# EAGLE design 5-Band 50W PA_50W PA_OCP (EAGLE 9.4.2)
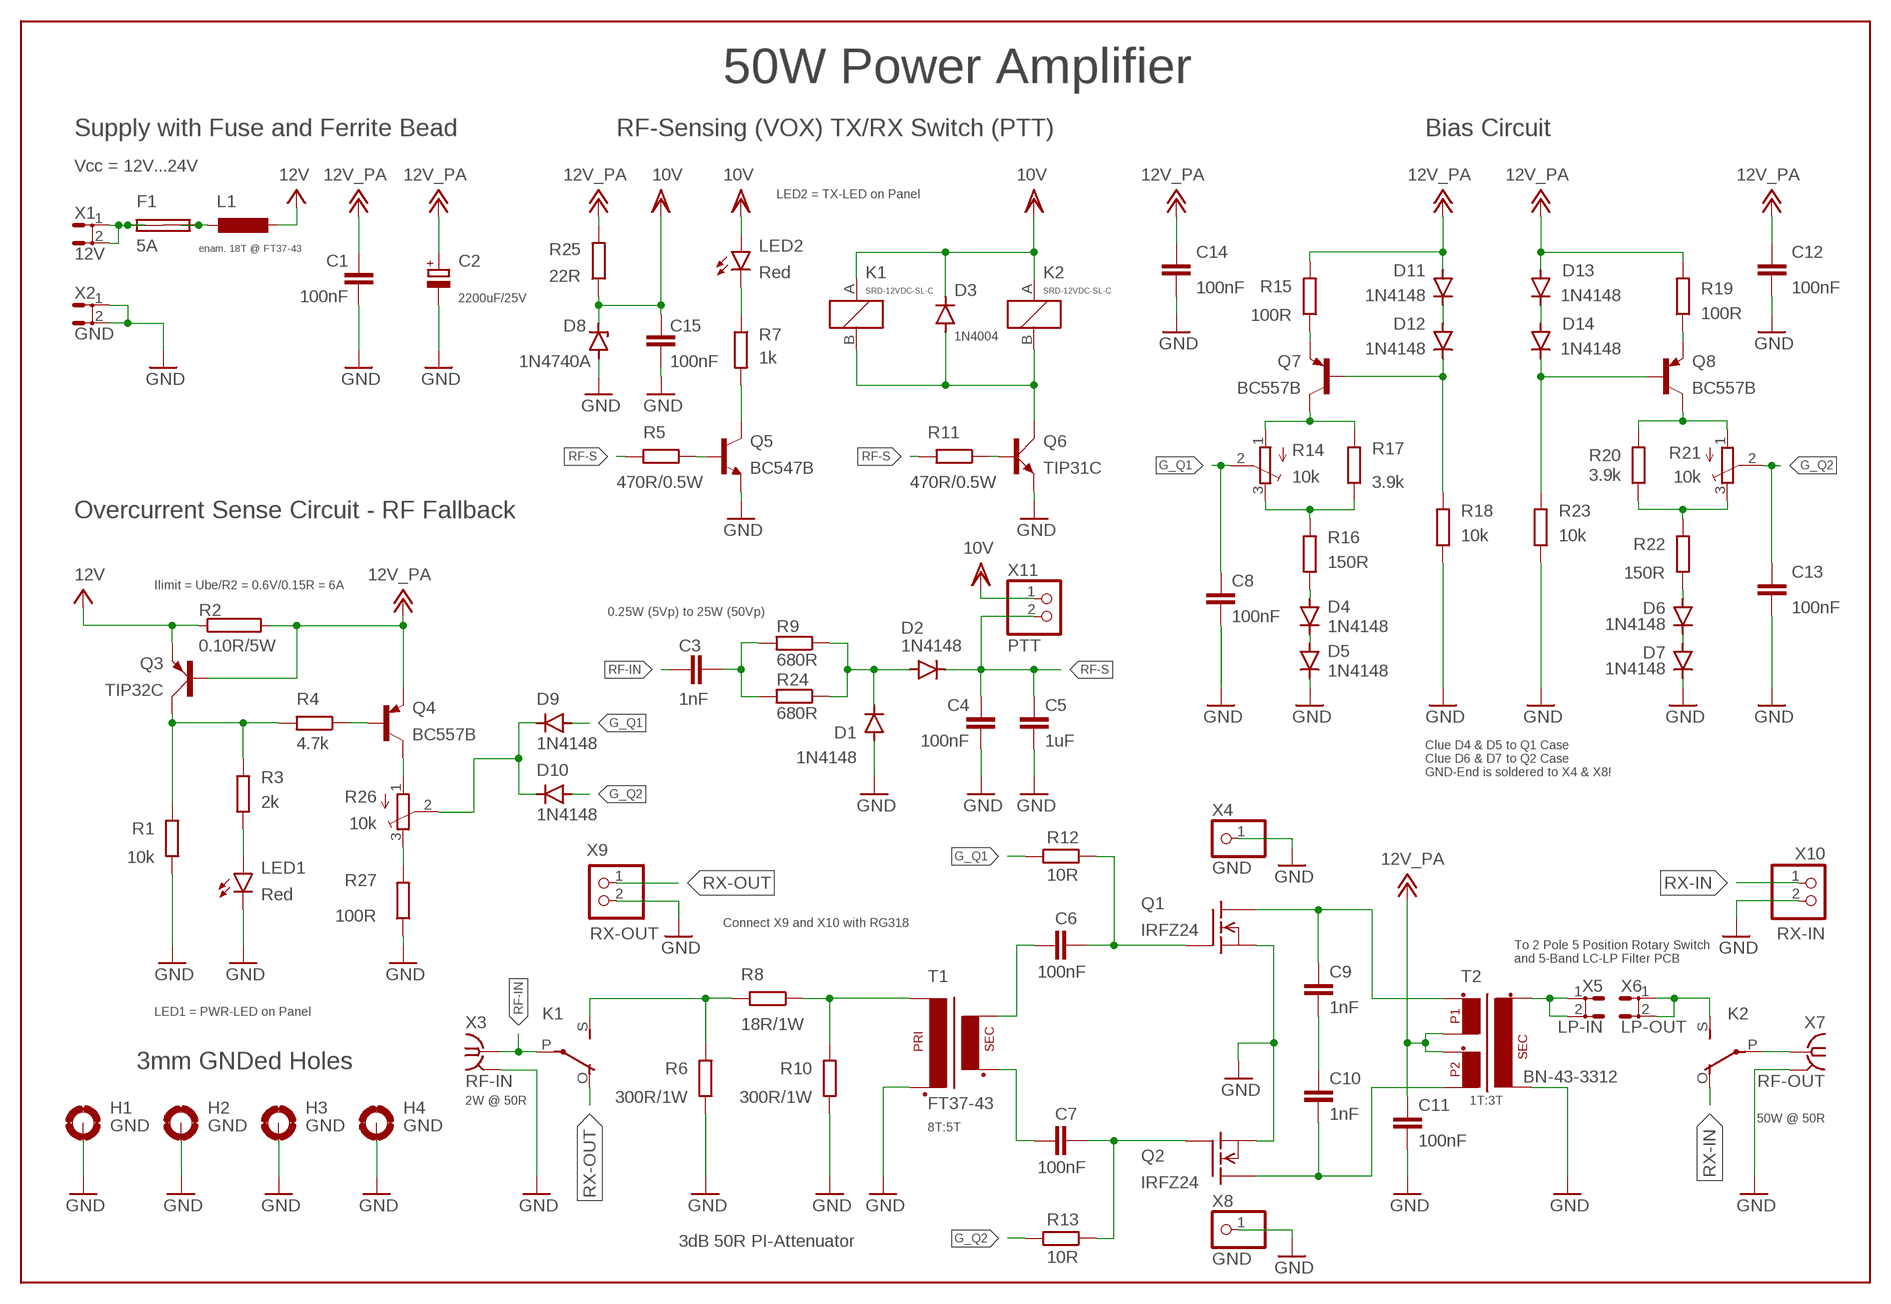
[diagram p0: schematic, sheet 1]

## Parts
C1  100nF  C-EUC0805  [C0805]
C2  2200uF/25V  CPOL-EUE7.5-16  [E7,5-16]
C3  1nF  C-EUC0805  [C0805]
C4  100nF  C-EUC0805  [C0805]
C5  1uF  C-EUC0805  [C0805]
C6  100nF  C-EUC0805  [C0805]
C7  100nF  C-EUC0805  [C0805]
C8  100nF  C-EUC0805  [C0805]
C9  1nF  C-EUC1206K  [C1206K]
C10  1nF  C-EUC1206K  [C1206K]
C11  100nF  C-EUC0805  [C0805]
C12  100nF  C-EUC0805  [C0805]
C13  100nF  C-EUC0805  [C0805]
C14  100nF  C-EUC0805  [C0805]
C15  100nF  C-EUC0805  [C0805]
D1  1N4148  DIODE-SOD323-W  [SOD323-W]
D2  1N4148  DIODE-SOD323-W  [SOD323-W]
D3  1N4004  [DO41-10]
D4  1N4148  1N4148DO35-7  [DO35-7]
D5  1N4148  1N4148DO35-7  [DO35-7]
D6  1N4148  1N4148DO35-7  [DO35-7]
D7  1N4148  1N4148DO35-7  [DO35-7]
D8  1N4740A  1N4728  [DO41Z10]
D9  1N4148  DIODE-SOD323-W  [SOD323-W]
D10  1N4148  DIODE-SOD323-W  [SOD323-W]
D11  1N4148  DIODE-SOD323-W  [SOD323-W]
D12  1N4148  DIODE-SOD323-W  [SOD323-W]
D13  1N4148  DIODE-SOD323-W  [SOD323-W]
D14  1N4148  DIODE-SOD323-W  [SOD323-W]
F1  5A  SHK20L  [SHK20L]
H1  GND  MOUNT-PAD-ROUND3.0  [3,0-PAD]
H2  GND  MOUNT-PAD-ROUND3.0  [3,0-PAD]
H3  GND  MOUNT-PAD-ROUND3.0  [3,0-PAD]
H4  GND  MOUNT-PAD-ROUND3.0  [3,0-PAD]
K1  SRD-12VDC-SL-C  [SRD-12VDC-SL-C]
K2  SRD-12VDC-SL-C  [SRD-12VDC-SL-C]
L1  enam. 18T @ FT37-43  T50-6  [T50-6SMD]
LED1  Red  LED5MM  [LED5MM]
LED2  Red  LED5MM  [LED5MM]
Q1  IRFZ24  IRF510  [TO220]
Q2  IRFZ24  IRF510  [TO220]
Q3  TIP32C  TIP42C  [TO220AV]
Q4  BC557B  [TO92-EBC]
Q5  BC547B  BC547B-NPN-TO92-CBE  [TO92-CBE]
Q6  TIP31C  TIP41C  [TO220AV]
Q7  BC557B  [TO92-EBC]
Q8  BC557B  [TO92-EBC]
R1  10k  R-EU_R0805  [R0805]
R2  0.10R/5W  RMNS-5  [MNS-5]
R3  2k  R-EU_R0805  [R0805]
R4  4.7k  R-EU_R0805  [R0805]
R5  470R/0.5W  R-EU_0207/10  [0207/10]
R6  300R/1W  R-EU_0414/15  [0414/15]
R7  1k  R-EU_R0805  [R0805]
R8  18R/1W  R-EU_0414/15  [0414/15]
R9  680R  R-EU_R0805  [R0805]
R10  300R/1W  R-EU_0414/15  [0414/15]
R11  470R/0.5W  R-EU_0207/10  [0207/10]
R12  10R  R-EU_0207/10  [0207/10]
R13  10R  R-EU_0207/10  [0207/10]
R14  10k  TRIM_EU-3223G  [3223G]
R15  100R  R-EU_R0805  [R0805]
R16  150R  R-EU_R0805  [R0805]
R17  3.9k  R-EU_R0805  [R0805]
R18  10k  R-EU_R0805  [R0805]
R19  100R  R-EU_R0805  [R0805]
R20  3.9k  R-EU_R0805  [R0805]
R21  10k  TRIM_EU-3223G  [3223G]
R22  150R  R-EU_R0805  [R0805]
R23  10k  R-EU_R0805  [R0805]
R24  680R  R-EU_R0805  [R0805]
R25  22R  R-EU_0207/10  [0207/10]
R26  10k  TRIM_EU-3223G  [3223G]
R27  100R  R-EU_R0805  [R0805]
T1  FT37-43  [FT37-43SMD]
T2  BN-43-3312  BN-43-3312CENTERTAP  [BN-43-3312CENTERTAPSMD]
X1  12V  ST6,3  [ST6,3]
X2  GND  ST6,3  [ST6,3]
X3  RF-IN  SMA-PCB-CON142-0711-821/826  [J502-ND-142-0711-821/826]
X4  GND  PINHD-1X1  [1X01]
X5  LP-IN  ST6,3  [ST6,3]
X6  LP-OUT  ST6,3  [ST6,3]
X7  RF-OUT  SMA-PCB-CON142-0711-821/826  [J502-ND-142-0711-821/826]
X8  GND  PINHD-1X1  [1X01]
X9  RX-OUT  PINHD-1X2  [1X02]
X10  RX-IN  PINHD-1X2  [1X02]
X11  PTT  PINHD-1X2  [1X02]

## Nets
+12V: C1.2 C2.+ C11.2 C12.2 C14.2 D11.A D13.A Q3.B Q4.E R2.2 R15.2 R19.2 R25.2 T2.P$2(P1_2) T2.P$3(P2_1) ; supply symbol labelled 12V_PA
G_Q1: C8.2 D9.A R12.2 R14.2(S)
G_Q2: C13.2 D10.A R13.2 R21.2(S)
GND: C1.1 C2.- C4.1 C5.1 C8.1 C11.1 C12.1 C13.1 C14.1 C15.1 D1.A D5.C D7.C D8.A H1.B3,0(MOUNT) H2.B3,0(MOUNT) H3.B3,0(MOUNT) H4.B3,0(MOUNT) LED1.K(C) Q1.3(S) Q2.3(S) Q5.E Q6.E R1.1 R6.1 R10.1 R18.1 R23.1 R27.1 T1.P$2(P2) T2.S$2(S2) X2.1 X2.2 X3.G@1(GND) X3.G@2(GND) X3.G@3(GND) X3.G@4(GND) X4.1 X7.G@1(GND) X7.G@2(GND) X7.G@3(GND) X7.G@4(GND) X8.1 X9.2 X10.2
N$1: C6.2 T1.S$1(S1)
N$2: C7.2 T1.S$2(S2)
N$3: LED2.K(C) R7.1
N$4: Q8.C R20.2 R21.1(A)
N$5: Q7.E R15.1
N$6: C9.1 Q1.2(D) T2.P$1(P1_1)
N$7: R20.1 R21.3(E) R22.2
N$8: C10.2 Q2.2(D) T2.P$4(P2_2)
N$9: K1.S R6.2 R8.2
N$10: K2.P X7.1(RF)
N$11: R8.1 R10.2 T1.P$1(P1)
N$12: D9.C D10.C R26.2(S)
N$13: D6.C D7.A
N$14: Q8.E R19.1
N$15: Q7.C R14.1(A) R17.2
N$16: D4.C D5.A
N$17: R14.3(E) R16.2 R17.1
N$18: D4.A R16.1
N$19: D6.A R22.1
N$20: D12.C Q7.B R18.2
N$21: C6.1 Q1.1(G) R12.1
N$22: C7.1 Q2.1(G) R13.1
N$23: K2.S X6.1 X6.2
N$24: D3.A K1.B(1:B) K2.B(1:B) Q6.C
N$25: D1.C D2.A R9.1 R24.1
N$26: D14.C Q8.B R23.2
N$27: Q6.B R11.1
N$28: F1.1A F1.1B X1.1 X1.2
N$29: R26.3(E) R27.2
N$30: F1.2A F1.2B L1.P$1
N$31: D11.C D12.A
N$32: Q5.C R7.2
N$33: Q5.B R5.1
N$34: C3.1 R9.2 R24.2
N$35: Q3.C R1.2 R3.2 R4.2
N$36: C9.2 C10.1
N$37: LED1.A R3.1
N$38: Q4.B R4.1
N$39: T2.S$1(S1) X5.1 X5.2
N$40: D13.C D14.A
N$41: Q4.C R26.1(A)
RF-IN: C3.2 K1.P X3.1(RF)
RF-S: C4.2 C5.2 D2.C R5.2 R11.2 X11.2
RX-IN: K2.O X10.1
RX-OUT: K1.O X9.1
VCC: L1.P$2 Q3.E R2.1 ; supply symbol labelled 12V
VDD: C15.2 D3.C D8.C K1.A(1:A) K2.A(1:A) LED2.A R25.1 X11.1 ; supply symbol labelled 10V

## Notes on the sheet
- 50W Power Amplifier
- Supply with Fuse and Ferrite Bead | RF-Sensing (VOX) TX/RX Switch (PTT) | Bias Circuit
- Vcc = 12V...24V
- LED2 = TX-LED on Panel
- Overcurrent Sense Circuit - RF Fallback
- Ilimit = Ube/R2 = 0.6V/0.15R = 6A
- 0.25W (5Vp) to 25W (50Vp)
- Clue D4 & D5 to Q1 Case
  Clue D6 & D7 to Q2 Case
  GND-End is soldered to X4 & X8!
- Connect X9 and X10 with RG318
- To 2 Pole 5 Position Rotary Switch 
  and 5-Band LC-LP Filter PCB
- LED1 = PWR-LED on Panel
- 3mm GNDed Holes
- 2W @ 50R | 1T:3T
- 50W @ 50R
- 8T:5T
- 3dB 50R PI-Attenuator

## Library data of the parts
C1 C3-C15 = rcl:C-EU: CAPACITOR, European symbol; SPICEPREFIX: C
C2 = rcl:CPOL-EU: POLARIZED CAPACITOR, European symbol; SPICEPREFIX: C
D1 D2 D9-D14 = diode:DIODE-: DIODE
D3 = diode:1N4004: DIODE general purpose rectifier, 1 A
D4-D7 = diode:1N4148: DIODE high speed (Philips)
D8 = diode:1N4728: Z DIODE 3.3 V, 1W, 5 percent
F1 = fuse:SHK20L: FUSE HOLDER 5 x 20 mm, SH contact, SHH1 Schukat, E1073 Buerklin; OC_FARNELL: unknown; OC_NEWARK: unknown
H1-H4 = holes:MOUNT-PAD-ROUND: MOUNTING PAD, round
K1 K2 = Ham Radio:SRD-12VDC-SL-C: RELAY horizontal, 1 x switch, 5 A/300 V DC, 250 V AC, Siemens
L1 = Ham Radio:T50-6
LED1 LED2 = led:LED: LED OSRAM: - CHIPLED LG R971, LG N971, LY N971, LG Q971, LY Q971, LO R971, LY R971 LH N974, LH R974 LS Q976, LO Q976, LY Q976 LO Q996 - Hyper CHIPLED LW Q18S LB Q993, LB Q99A, LB R99A - SideLED LS A670, LO A670, LY A670, LG A670, LP A670 LB A673, LV A673, LT A673, LW A673 LH A674 LY A675 LS A676, LA A676, LO A676, LY A676, LW A676 LS A679, LY A679, LG A679 - Hyper Micro SIDELED® LS Y876, LA Y876, LO Y876, LY Y876 LT Y87S - SmartLED LW L88C, LW L88S LB L89C, LB L89S, LG L890 LS L89K, LO L89K, LY L89K LS L896, LA L896, LO L896, LY L896 - TOPLED LS T670, LO T670, LY T670, LG T670, LP T670 LSG T670, LSP T670, LSY T670, LOP T670, LYG T670 LG T671, LOG T671, LSG T671 LB T673, LV T673, LT T673, LW T673 LH T674 LS T676, LA T676, LO T676, LY T676, LB T676, LH T676, LSB T676, LW T676 LB T67C, LV T67C, LT T67C, LS T67K, LO T67K, LY T67K, LW E67C LS E67B, LA E67B, LO E67B, LY E67B, LB E67C, LV E67C, LT E67C LW T67C LS T679, LY T679, LG T679 LS T770, LO T770, LY T770, LG T770, LP T770 LB T773, LV T773, LT T773, LW T773 LH T774 LS E675, LA E675, LY E675, LS T675 LS T776, LA T776, LO T776, LY T776, LB T776 LHGB T686 LT T68C, LB T68C - Hyper Mini TOPLED® LB M676 - Mini TOPLED Santana® LG M470 LS M47K, LO M47K, LY M47K Source: http://www.osram.convergy.de LUXEON: - LUMILED® LXK2-PW12-R00, LXK2-PW12-S00, LXK2-PW14-U00, LXK2-PW14-V00 LXK2-PM12-R00, LXK2-PM12-S00, LXK2-PM14-U00 LXK2-PE12-Q00, LXK2-PE12-R00, LXK2-PE12-S00, LXK2-PE14-T00, LXK2-PE14-U00 LXK2-PB12-K00, LXK2-PB12-L00, LXK2-PB12-M00, LXK2-PB14-N00, LXK2-PB14-P00, LXK2-PB14-Q00 LXK2-PR12-L00, LXK2-PR12-M00, LXK2-PR14-Q00, LXK2-PR14-R00 LXK2-PD12-Q00, LXK2-PD12-R00, LXK2-PD12-S00 LXK2-PH12-R00, LXK2-PH12-S00 LXK2-PL12-P00, LXK2-PL12-Q00, LXK2-PL12-R00 Source: www.luxeon.com KINGBRIGHT: KA-3528ASYC Source: www.kingbright.com
Q1 Q2 = transistor-fet:IRF510: N-Channel Enhancement MOSFET (HEXFET); 100V; 5,6A; 0,54Ohm
Q3 = transistor-power:TIP42C: PNP TRANSISTOR
Q4 Q7 Q8 = transistor-pnp:BC557*: PNP Transistror
Q5 = transistor:*-NPN-: NPN Transistror BF959 corrected 2008.03.06
Q6 = transistor-power:TIP41C: NPN TRANSISTOR
R1 R3-R13 R15-R20 R22-R25 R27 = rcl:R-EU_: RESISTOR, European symbol; SPICEPREFIX: R
R2 = resistor-power:R: Power Resitor; OC_FARNELL: unknown; OC_NEWARK: unknown
R14 R21 R26 = pot:TRIM_EU-: POTENTIOMETER
T1 = Ham Radio:FT37-43
T2 = Ham Radio:BN-43-3312CENTERTAP
X1 X2 X5 X6 = con-rib:ST6,3: RIBBON CABLE CONNECTOR Flachstecker / Faston; OC_FARNELL: unknown; OC_NEWARK: unknown
X3 X7 = Ham Radio:SMA-PCB-CON: SMA 50 Ohm End Launch Jack Receptacle - Round Contact Johnson Components Source: www.johnsoncomponents.com .. J502-ND.pdf; MF: JOHNSON COMPONENTS; MPN: 142-0711-821; OC_FARNELL: 1019328; OC_NEWARK: 16F3627
X4 X8 = pinhead:PINHD-1X1: PIN HEADER
X9-X11 = pinhead:PINHD-1X2: PIN HEADER

## Board
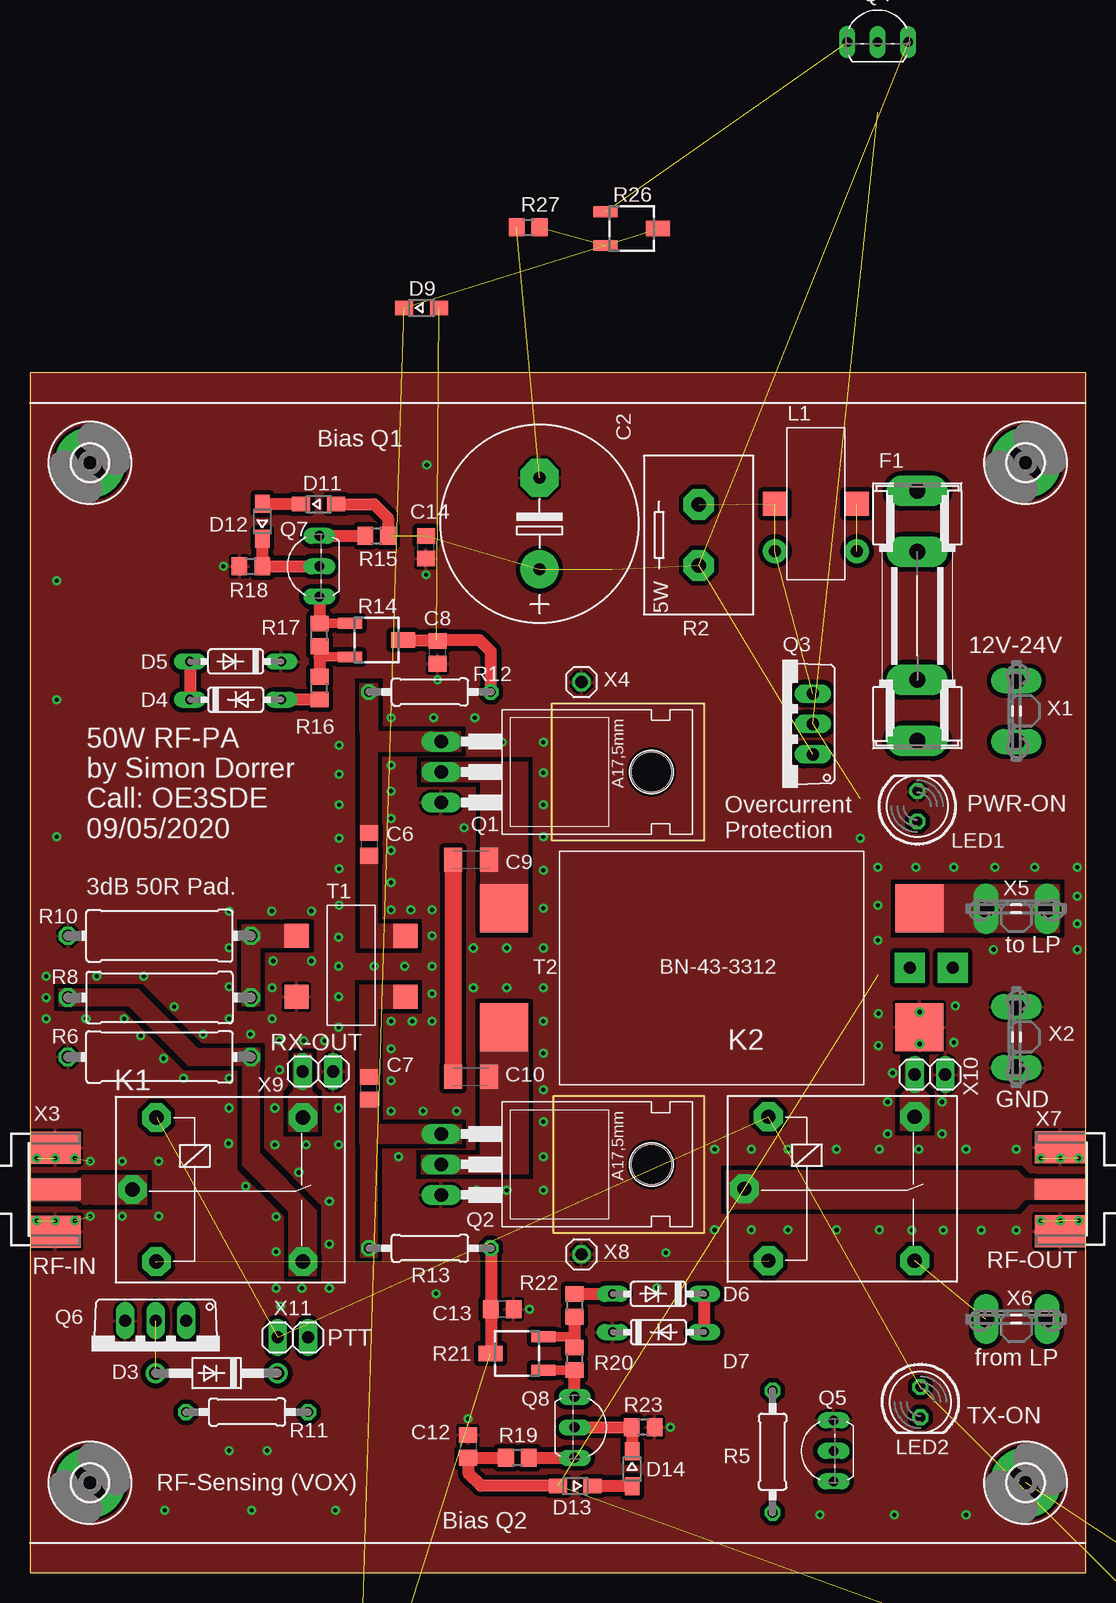
[diagram p1: board, top side]
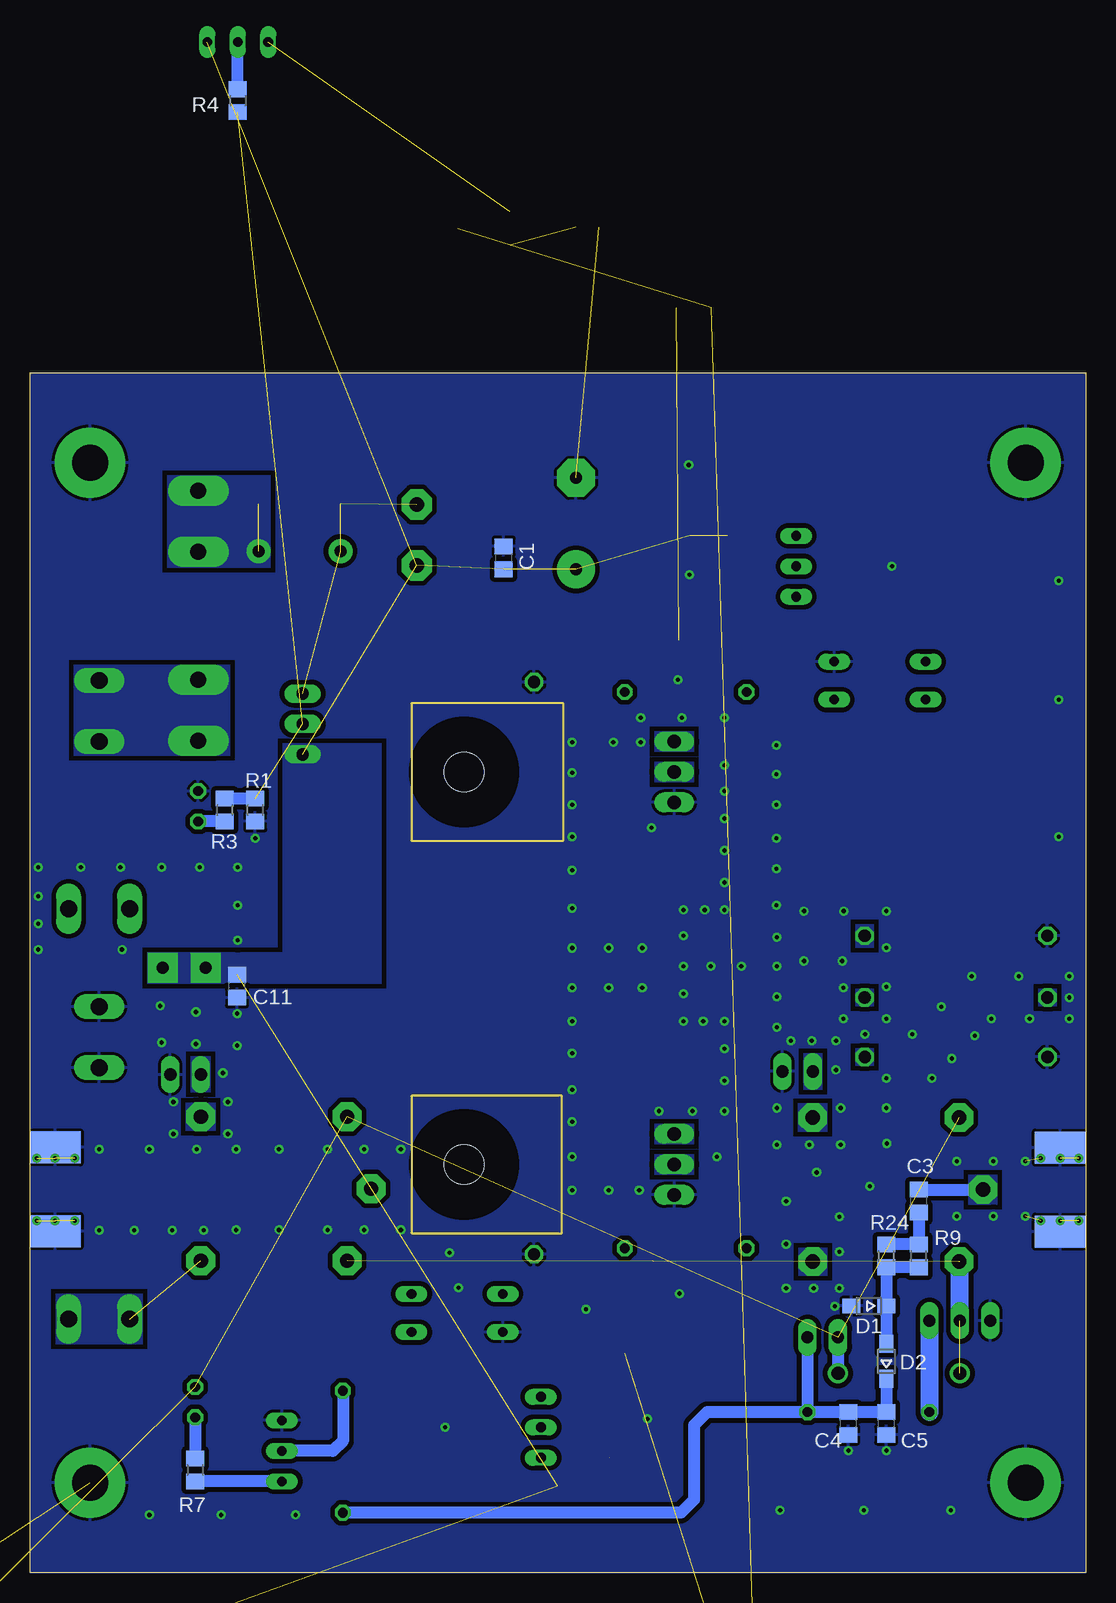
[diagram p2: board, bottom side, seen from below]

Size 88 x 100 mm. Coordinates in mm from the lower left corner, seen from the top.
Outline: 0,0 88,0 88,100 0,100 0,0
Copper layers (1*16): Top 0.035mm / dielectric 1.5mm / Bottom 0.035mm
Design rules "default *": minimum track width 6mil, minimum drill 0.35mm, track to track 6mil, track to pad 6mil, pad to pad 6mil, via to via 6mil, smd to smd 6mil, copper to edge 0mil, drill to drill 6mil, minimum pad ring 10mil, minimum via ring 8mil, stop-mask expansion 4mil, vias tented up to drill 0mil, thermal gap 10mil
Milling: 8 lines

### Footprints (pad centres in the part's own frame; a part is rotated, then mirrored left to right if it is on the bottom)
C0805 = smd 1.3 x 1.5: 1 -0.95,0; 2 0.95,0
E7,5-16 = drill 1.016 pad 3.15: + -3.81,0 | drill 1.016 pad 3.15 octagon: - 3.81,0
C1206K = smd 1.5 x 2: 1 -1.5,0; 2 1.5,0
SOD323-W = smd 1.5 x 1.2: A 1.45,0; C -1.45,0
DO41-10 = drill 1.118: A 5.08,0; C -5.08,0
DO35-7 = drill 0.813 long: A 3.81,0; C -3.81,0
DO41Z10 = drill 1.118: A 5.08,0; C -5.08,0
SHK20L = drill 1.321 pad 2.54 long: 1A -10.414,0; 1B -5.334,0; 2A 10.414,0; 2B 5.334,0
3,0-PAD = drill 3 pad 5.842: B3,0 0,0
SRD-12VDC-SL-C = drill 1.2 pad 2.4 octagon: A -5.998,6.13; B -5.998,-5.87; O 6.202,6.13; P -7.998,0.13; S 6.202,-5.87
T50-6SMD = smd 2 x 2: P$1 -3.54,0; P$2 3.29,0
LED5MM = drill 0.813 octagon: A -1.27,0; K 1.27,0
TO220 = drill 1.118 long: 1 -2.54,-6.35; 2 0,-6.35; 3 2.54,-6.35 | hole 3.302: 0,11.176
TO220AV = drill 1.016 long: B -2.54,-2.54; C 0,-2.54; E 2.54,-2.54
TO92-EBC = drill 0.813 long: B 0,-1.27; C -2.54,-1.27; E 2.54,-1.27
TO92-CBE = drill 0.813 long: B 0,0; C -2.54,0; E 2.54,0
R0805 = smd 1.3 x 1.5: 1 -0.95,0; 2 0.95,0
MNS-5 = drill 1.194 pad 2.54 octagon: 1 -2.54,0; 2 2.54,0
0207/10 = drill 0.813 octagon: 1 -5.08,0; 2 5.08,0
0414/15 = drill 1.016 octagon: 1 -7.62,0; 2 7.62,0
3223G = smd 2 x 0.9: 1 -2.2,1.4; 3 -2.2,-1.4 | smd 2 x 1.3: 2 2.2,0
FT37-43SMD = smd 2 x 2: P$1 -5.08,0; P$2 -5.08,-5.08; S$1 4,0; S$2 4,-5.08
BN-43-3312CENTERTAPSMD = smd 4 x 4: P$1 -4.6,14.675; P$4 -4.6,4.775; S$1 30,14.675; S$2 30,4.775 | drill 1 pad 2.5 square: P$2 29.21,9.725; P$3 32.794,9.725
ST6,3 = drill 1.397 long: 1 -2.54,0; 2 2.54,0
J502-ND-142-0711-821/826 = smd 4.191 x 1.778: 1 2.115,0 | smd 4.191 x 2.667: G@1 2.115,3.495; G@2 2.115,-3.495 | smd 4.191 x 2.667 bottom: G@3 2.115,3.495; G@4 2.115,-3.495
1X01 = drill 1.016 octagon: 1 0,0
1X02 = drill 1.016 long: 1 -1.27,0; 2 1.27,0

### Placement (x,y rotation side)
C1  48.51,84.58 270 bottom
C2  42.48,87.44 90 top
C3  13.91,30.99 90 bottom
C4  19.78,12.45 90 bottom
C5  16.61,12.45 90 bottom
C6  28.26,60.71 270 top
C7  28.26,40.39 90 top
C8  33.97,76.71 90 top
C9  36.79,59.45 180 top
C10  36.77,41.34 0 top
C11  70.74,48.9 90 bottom
C12  36.51,10.54 270 top
C13  39.37,21.97 180 top
C14  33.02,85.47 90 top
C15  105.28,-20.57 0 top  (outside the outline)
D1  18.07,22.24 180 bottom
D2  16.61,17.62 90 bottom
D3  15.56,16.64 180 top
D4  17.14,72.77 0 top
D5  17.14,75.95 180 top
D6  52.39,23.24 180 top
D7  52.39,20.07 0 top
D8  105.79,-10.79 0 top  (outside the outline)
D9  32.64,105.41 0 top  (outside the outline)
D10  29.08,-6.6 0 top  (outside the outline)
D11  24.07,89.06 0 top
D12  19.37,87.63 90 top
D13  45.47,7.24 180 top
D14  50.2,8.67 270 top
F1  73.98,79.76 90 top
H1  83,92.5 0 top
H2  83,7.5 0 top
H3  5,7.5 0 top
H4  5,92.5 0 top
K1  16.54,31.81 0 top
K2  67.56,31.88 0 top
L1  65.41,89.09 180 top
LED1  73.98,63.88 90 top
LED2  74.23,14.22 270 top
Q1  40.64,66.74 270 top
Q2  40.64,34.04 270 top
Q3  62.74,70.74 90 top
Q4  70.68,128.84 0 top  (outside the outline)
Q5  66.99,10.16 90 top
Q6  10.48,18.48 180 top
Q7  22.86,83.88 90 top
Q8  46.67,12.13 270 top
R1  69.22,63.56 90 bottom
R2  55.75,86.49 270 top
R3  71.75,63.56 90 bottom
R4  70.68,122.68 270 bottom  (outside the outline)
R5  61.91,10.1 270 top
R6  10.79,43 0 top
R7  74.23,8.57 270 bottom
R8  10.79,47.94 180 top
R9  13.91,26.42 90 bottom
R10  10.79,53.09 0 top
R11  18.1,13.4 0 top
R12  33.34,73.41 0 top
R13  33.34,27.05 0 top
R14  28.89,77.72 0 top
R15  28.89,86.42 0 top
R16  24.13,73.72 90 top
R17  24.13,78.17 90 top
R18  18.41,83.88 0 top
R19  40.64,9.59 180 top
R20  45.4,17.84 270 top
R21  40.61,18.29 180 top
R22  45.4,22.29 270 top
R23  51.12,12.13 180 top
R24  16.61,26.42 90 bottom
R25  105.28,-16.76 0 top  (outside the outline)
R26  50.16,112.01 0 top  (outside the outline)
R27  41.53,112.14 0 top  (outside the outline)
T1  27.3,53.09 0 top
T2  44.13,40.69 0 top
X1  82.23,71.82 270 top
X2  82.23,44.64 270 top
X3  0,31.94 0 top
X4  45.97,74.23 0 top
X5  82.23,55.34 180 top
X6  82.23,21.15 180 top
X7  88,31.97 180 top
X8  45.97,26.54 0 top
X9  24,41.78 0 top
X10  75.03,41.53 0 top
X11  21.91,19.62 0 top

### Tracks (layer width: path | path; a pad name or v marks a point on that pad's centre or on a via)
+12V  (9 unrouted)
  Top 1: R15.2 29.84,87.89 28.67,89.06 D11.A | C14.2 | R19.2 C12.2 36.58,9.53 36.58,8.26 37.59,7.24 D13.A
  pour Bottom (isolate 0.6, no thermals): 58.67,69.09 66.93,69.09 66.93,51.69 78.23,51.69 78.23,49.15 58.67,49.15
G_Q1  (1 unrouted)
  Top 1: R14.2 33.91,77.72 | 33.91,77.72 C8.2 | R12.2 38.42,76.77 37.47,77.72 33.91,77.72
G_Q2  (1 unrouted)
  Top 1: R21.2 C13.2 R13.2
GND  (via drill 0.35)  (11 unrouted)
  other vias: 20.89,22.23 77.15,47.24 70.68,58.8 73.85,58.8 77.03,58.8 80.45,58.8 83.76,58.8 87.31,58.8 87.31,56.39 87.31,54.1 87.31,51.94 80.33,51.94 70.68,52.7 70.68,55.63 70.8,35.31 74.1,35.31 78.04,35.31 82.23,35.31 70.74,46.61 70.74,43.94 67.25,35.31 57.09,35.31 63.18,35.31 57.09,28.57 60.13,35.31 84.26,34.54 85.92,34.54 87.44,34.54 84.26,29.34 85.92,29.34 87.44,29.34 3.75,34.54 2.1,34.54 0.57,34.54 3.75,29.34 2.1,29.34 0.57,29.34 5.02,34.29 7.68,34.29 10.73,34.29 10.73,29.72 7.68,29.72 5.02,29.72 76.14,28.54 60.13,28.57 63.18,28.57 67.25,28.57 70.8,28.57 79.31,28.54 82.23,28.54 73.53,28.54 25.72,35.69 25.72,38.73 25.72,45.47 20.29,50.99 25.78,58.67 25.78,55.63 33.53,48.26 33.53,50.55 31.24,50.55 30.1,45.97 33.53,45.97 28.7,50.55 25.72,50.55 25.72,48.01 30.1,43.69 30.1,38.48 32.77,38.48 35.56,38.48 30.73,34.67 30.1,41.02 25.72,52.96 25.78,61.21 25.78,64.01 25.78,66.55 25.78,68.96 33.53,53.09 33.53,55.24 30.1,55.24 31.75,55.24 30.1,57.53 30.1,60.2 30.1,62.87 30.1,65.15 30.1,67.31 31.88,45.97 30.1,71.25 37.08,69.22 37.08,71.25 33.66,71.25 36.96,52.07 39.75,52.07 42.8,52.07 39.37,69.22 42.8,66.67 42.8,69.22 42.8,61.34 42.8,55.37 42.8,58.55 42.8,64.01 42.8,48.77 39.75,48.77 36.96,48.77 42.8,45.97 42.8,43.31 42.8,40.26 42.8,37.59 42.8,34.67 37.21,31.88 39.75,31.88 42.8,31.88 36.2,62.1 11.24,5.21 18.48,5.21 25.46,5.21 65.85,4.83 72.07,4.83 78.04,4.83 16.61,10.19 19.78,10.19 16.13,83.88 33.02,83.19 69.22,61.21 53.4,12.13 41.66,21.97 36.51,12.83 33.97,74.42 2.22,82.68 2.22,72.77 2.22,61.34 33.08,92.33 53.02,26.67 52.26,23.75 33.85,23.27 77.03,44.2 23.02,35.69 20.42,38.73 20.42,35.69 20.8,41.91 22.83,44.35 24.57,44.35 22.67,23.72 20.51,23.72 24.96,23.72 24.96,27.4 24.96,30.96 22.42,33.37 20.51,26.77 20.51,29.69 16.57,35.78 17.97,32.23 16.61,41.21 16.61,38.73 18.38,44.89 16.61,48.83 23.46,50.99 20.19,48.77 16.61,46.16 20.19,46.16 20.8,44.35 16.61,52.1 16.61,55.15 20.16,55.15 23.46,55.15 7.84,46.16 1.37,46.16 4.67,46.16 1.37,49.72 1.37,47.94 5.56,49.72 9.49,49.72 14.45,44.89 12.03,47.18 12.8,41.21 11.14,42.86 9.24,44.77 71.5,39.24 71.5,36.58 71.91,41.66 76.04,39.24 76.04,36.58 74.17,46.74 74.17,44.07
  pour Top (isolate 0.4, rank 3): 0,0 0,100 88,100 88,0
  pour Bottom (isolate 0.4, rank 3): 0,0 0,100 88,100 88,0
N$1
  pour Top (isolate 0.6, no thermals): 27.53,60.39 27.53,52.1 32.29,52.1 32.29,54.07 28.99,54.07 28.99,60.39
N$2
  pour Top (isolate 0.6, no thermals): 27.53,40.7 27.53,48.99 32.29,48.99 32.29,47.02 28.99,47.02 28.99,40.7
N$3
  Bottom 1: LED2.K R7.1
N$4
  Top 0.8: R21.1 R20.2
  Top 1: Q8.C R20.2
N$5
  Top 1: Q7.E R15.1
N$6
  pour Top (isolate 0.8, no thermals): 41.53,53.37 41.53,67.56 32.64,67.56 32.64,65.91 37.56,65.91 37.56,53.37
  pour Bottom (isolate 0.6, no thermals): 35.94,67.56 35.94,65.91 32.64,65.91 32.64,67.56
N$7
  Top 0.8: R21.3 45.4,19.69 45.4,19.68
  Top 1: R22.2 45.4,19.68 R20.1
N$8
  pour Top (isolate 0.8, no thermals): 32.64,34.86 37.56,34.86 37.56,47.43 41.53,47.43 41.53,33.21 32.64,33.21
  pour Bottom (isolate 0.6, no thermals): 35.94,34.86 35.94,33.21 32.64,33.21 32.64,34.86
N$9
  pour Bottom (isolate 0.6, no thermals): 2.44,48.67 2.44,47.21 3.91,47.21 3.91,48.67
  pour Bottom (isolate 0.6, no thermals): 17.68,43.72 17.68,42.26 19.15,42.26 19.15,43.72
  pour Top (isolate 0.6, no thermals): 21.56,24.77 23.91,24.77 23.91,30.19 19.15,34.96 19.15,43.72 17.68,43.72 17.68,34 21.56,30.13
  pour Bottom (isolate 0.6, no thermals): 21.56,27.08 21.56,24.77 23.91,24.77 23.91,27.08
  pour Top (isolate 0.6, no thermals): 19.15,42.26 13.24,42.26 8.29,47.21 2.44,47.21 2.44,48.67 8.99,48.67 13.94,43.72 19.15,43.72
N$10
  pour Top (isolate 1.27, no thermals): 88.01,32.83 82.99,32.83 82.3,33.53 58.04,33.53 58.04,30.35 82.23,30.35 82.99,31.11 88.01,31.11
N$11
  pour Top (isolate 0.6, no thermals): 19.15,47.21 17.68,47.21 17.68,54.07 23.21,54.07 23.21,52.1 19.15,52.1
  pour Bottom (isolate 0.6, no thermals): 17.68,48.67 17.68,47.21 19.15,47.21 19.15,48.67
  pour Bottom (isolate 0.6, no thermals): 17.68,54.07 17.68,52.1 19.15,52.1 19.15,54.07
N$12  (2 unrouted)
N$13
  Top 1: D6.C D7.A
N$14
  Top 1: R19.1 Q8.E
N$15
  Top 0.8: R14.1 R17.2
  Top 1: Q7.C R17.2
N$16
  Top 1: D5.A D4.C
N$17
  Top 0.8: R14.3 24.13,76.32 24.13,76.33
  Top 1: R17.1 24.13,76.33 R16.2
N$18
  Top 1: R16.1 D4.A
N$19
  Top 1: R22.1 D6.A
N$20
  Top 1: Q7.B R18.2 D12.C
N$21
  pour Top (isolate 0.6, no thermals): 27.53,61.02 28.99,61.02 28.99,68.45 35.94,68.45 35.94,70.1 27.53,70.1
  pour Top (isolate 0.6, no thermals): 27.53,70.1 27.53,74.14 28.99,74.14 28.99,70.1
  pour Bottom (isolate 0.6, no thermals): 35.94,70.1 35.94,68.45 32.64,68.45 32.64,70.1
N$22
  pour Top (isolate 0.6, no thermals): 27.53,40.07 28.99,40.07 28.99,37.4 35.94,37.4 35.94,35.75 27.53,35.75
  pour Top (isolate 0.6, no thermals): 27.53,35.75 27.53,26.32 28.99,26.32 28.99,35.75
  pour Bottom (isolate 0.6, no thermals): 35.94,37.4 35.94,35.75 32.64,35.75 32.64,37.4
N$23  (1 unrouted)
  pour Bottom (isolate 0.6, no thermals): 78.64,23.24 78.64,19.05 85.82,19.05 85.82,23.24
N$24  (3 unrouted)
  Bottom 1.5: Q6.C 10.48,25.91
N$25
  Bottom 1: R9.1 R24.1 16.61,22.26 D1.C 16.62,19.09 D2.A
N$26
  Top 1: Q8.B R23.2 50.17,10.15 D14.C
N$27
  Bottom 1.5: Q6.B R11.1
N$28
  pour Bottom (isolate 0.8, no thermals): 71.37,75.69 71.37,68.07 84.33,68.07 84.33,75.69
N$29  (1 unrouted)
N$30  (via drill 1 pad 2)  (1 unrouted)
  Bottom 1: v68.94,85.15 68.96,85.14
  pour Bottom (isolate 0.8, no thermals): 76.58,83.82 67.94,83.82 67.94,91.44 76.58,91.44
N$31
  Top 1: D11.C 19.39,89.06 D12.A
N$32
  Bottom 1: Q5.C R7.2
N$33
  Bottom 1: R5.1 61.91,10.99 62.74,10.16 Q5.B
N$34
  Bottom 1: C3.1 R9.2 R24.2
N$35  (2 unrouted)
  Bottom 1: R1.2 R3.2
N$36
  Top 1.4: C9.2 35.29,41.36 C10.1
N$37
  Bottom 1: R3.1 LED1.A
N$38
  Bottom 1: R4.1 Q4.B
N$39
  pour Top (isolate 1, no thermals): 72.14,53.4 85.85,53.4 85.85,57.34 72.14,57.34
N$40
  Top 1: D13.C 50.17,7.24 D14.A
N$41  (1 unrouted)
RF-IN
  Bottom 1: C3.2 K1.P
  pour Top (isolate 0.6, no thermals): 0,30.99 4.19,30.99 4.45,30.73 9.78,30.73 9.78,33.15 4.45,33.15 4.19,32.89 0,32.89
  pour Bottom (isolate 0.6, no thermals): 9.78,33.15 9.78,30.73 7.37,30.73 7.37,33.15
RF-S
  Bottom 1: R5.2 33.72,5.02 32.64,6.1 32.64,12.32 31.56,13.4 R11.2 | X11.2 R11.2 | D2.C C5.2 C4.2 R11.2
RX-IN
  pour Top (isolate 0.6, no thermals): 72.58,36.83 72.58,39.81 72.99,40.23 72.99,43.05 74.52,43.05 74.52,40.26 74.96,39.81 74.96,36.83
  pour Bottom (isolate 0.6, no thermals): 72.58,39.18 72.58,36.83 74.96,36.83 74.96,39.18
  pour Bottom (isolate 0.6, no thermals): 72.99,40.04 74.55,40.04 74.55,43.05 72.99,43.05
RX-OUT
  pour Top (isolate 0.6, no thermals): 21.56,36.77 21.56,39.75 21.97,40.16 21.97,43.31 23.5,43.31 23.5,40.2 23.94,39.75 23.94,36.77
  pour Bottom (isolate 0.6, no thermals): 21.56,39.12 21.56,36.77 23.94,36.77 23.94,39.12
  pour Bottom (isolate 0.6, no thermals): 21.97,43.31 21.97,40.26 23.5,40.26 23.5,43.31
VCC  (via drill 1 pad 2)  (3 unrouted)
  Bottom 1: v62.12,85.15 62.12,85.1 62.1,85.09
VDD  (6 unrouted)
  Bottom 1: X11.1 D3.C

### Text on the board
tNames: Bias Q1 | 12V-24V | PWR-ON | 50W RF-PA / by Simon Dorrer / Call: OE3SDE / 09/05/2020 | Overcurrent / Protection | 3dB 50R Pad. | to LP | BN-43-3312 | RX-OUT | GND | RF-IN | RF-OUT | PTT | from LP | TX-ON | RF-Sensing (VOX) | Bias Q2